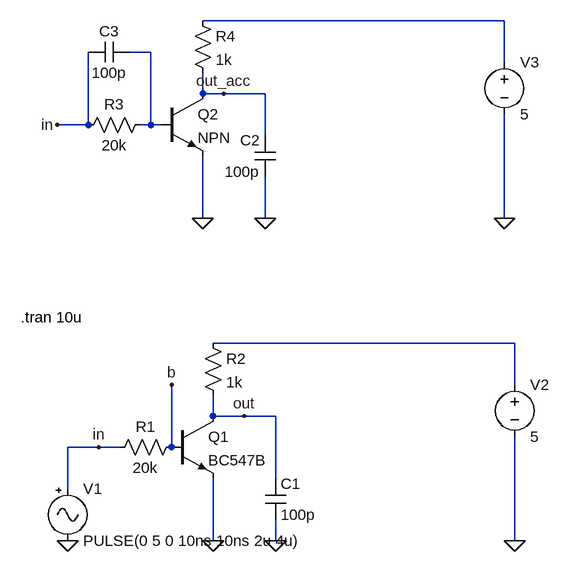
[diagram p0: schematic 3.8.asc]
3.8.asc, the LTspice schematic file:
Version 4
SHEET 1 880 936
WIRE 560 -32 96 -32
WIRE 16 16 -16 16
WIRE 560 32 560 -32
WIRE 96 80 96 48
WIRE 128 80 96 80
WIRE 192 80 128 80
WIRE -80 128 -80 16
WIRE -80 128 -128 128
WIRE 16 128 16 16
WIRE 16 128 0 128
WIRE 32 128 16 128
WIRE 192 144 192 80
WIRE 96 272 96 176
WIRE 192 272 192 208
WIRE 560 272 560 112
WIRE 576 464 112 464
WIRE 576 528 576 464
WIRE 112 576 112 544
WIRE 160 576 112 576
WIRE 208 576 160 576
WIRE -64 624 -112 624
WIRE -32 624 -64 624
WIRE 48 624 48 528
WIRE 208 672 208 576
WIRE -112 688 -112 624
WIRE 112 768 112 672
WIRE 208 768 208 736
WIRE 576 768 576 608
FLAG 96 272 0
FLAG 192 272 0
FLAG 560 272 0
FLAG -128 128 in
FLAG 128 80 out_acc
FLAG -112 768 0
FLAG 112 768 0
FLAG 208 768 0
FLAG 576 768 0
FLAG -64 624 in
FLAG 160 576 out
FLAG 48 528 b
SYMBOL res 16 112 R90
WINDOW 0 0 56 VBottom 2
WINDOW 3 32 56 VTop 2
SYMATTR InstName R3
SYMATTR Value 20k
SYMBOL res 80 -48 R0
SYMATTR InstName R4
SYMATTR Value 1k
SYMBOL voltage 560 16 R0
WINDOW 123 0 0 Left 0
WINDOW 39 0 0 Left 0
SYMATTR InstName V3
SYMATTR Value 5
SYMBOL cap 208 208 R180
WINDOW 0 24 56 Left 2
WINDOW 3 24 8 Left 2
SYMATTR InstName C2
SYMATTR Value 100p
SYMBOL npn 32 80 R0
SYMATTR InstName Q2
SYMBOL cap -16 0 R90
WINDOW 0 0 32 VBottom 2
WINDOW 3 32 32 VTop 2
SYMATTR InstName C3
SYMATTR Value 100p
SYMBOL Misc\\signal -112 672 R0
WINDOW 123 0 0 Left 0
WINDOW 39 0 0 Left 0
SYMATTR InstName V1
SYMATTR Value PULSE(0 5 0 10ns 10ns 2u 4u)
SYMBOL res 64 608 R90
WINDOW 0 0 56 VBottom 2
WINDOW 3 32 56 VTop 2
SYMATTR InstName R1
SYMATTR Value 20k
SYMBOL res 96 448 R0
SYMATTR InstName R2
SYMATTR Value 1k
SYMBOL voltage 576 512 R0
WINDOW 123 0 0 Left 0
WINDOW 39 0 0 Left 0
SYMATTR InstName V2
SYMATTR Value 5
SYMBOL cap 192 672 R0
SYMATTR InstName C1
SYMATTR Value 100p
SYMBOL npn 48 576 R0
SYMATTR InstName Q1
SYMATTR Value BC547B
TEXT -184 424 Left 2 !.tran 10u

The netlist it stands for:
* 3.8.asc
R3 N002 in 20k
R4 N001 out_acc 1k
V3 N001 0 5
C2 0 out_acc 100p
Q2 out_acc N002 0 0 NPN
C3 N002 in 100p
V1 in 0 PULSE(0 5 0 10ns 10ns 2u 4u)
R1 b in 20k
R2 N003 out 1k
V2 N003 0 5
C1 out 0 100p
Q1 out b 0 0 BC547B
.model NPN NPN
.model PNP PNP
.lib standard.bjt
.tran 10u
.backanno
.end